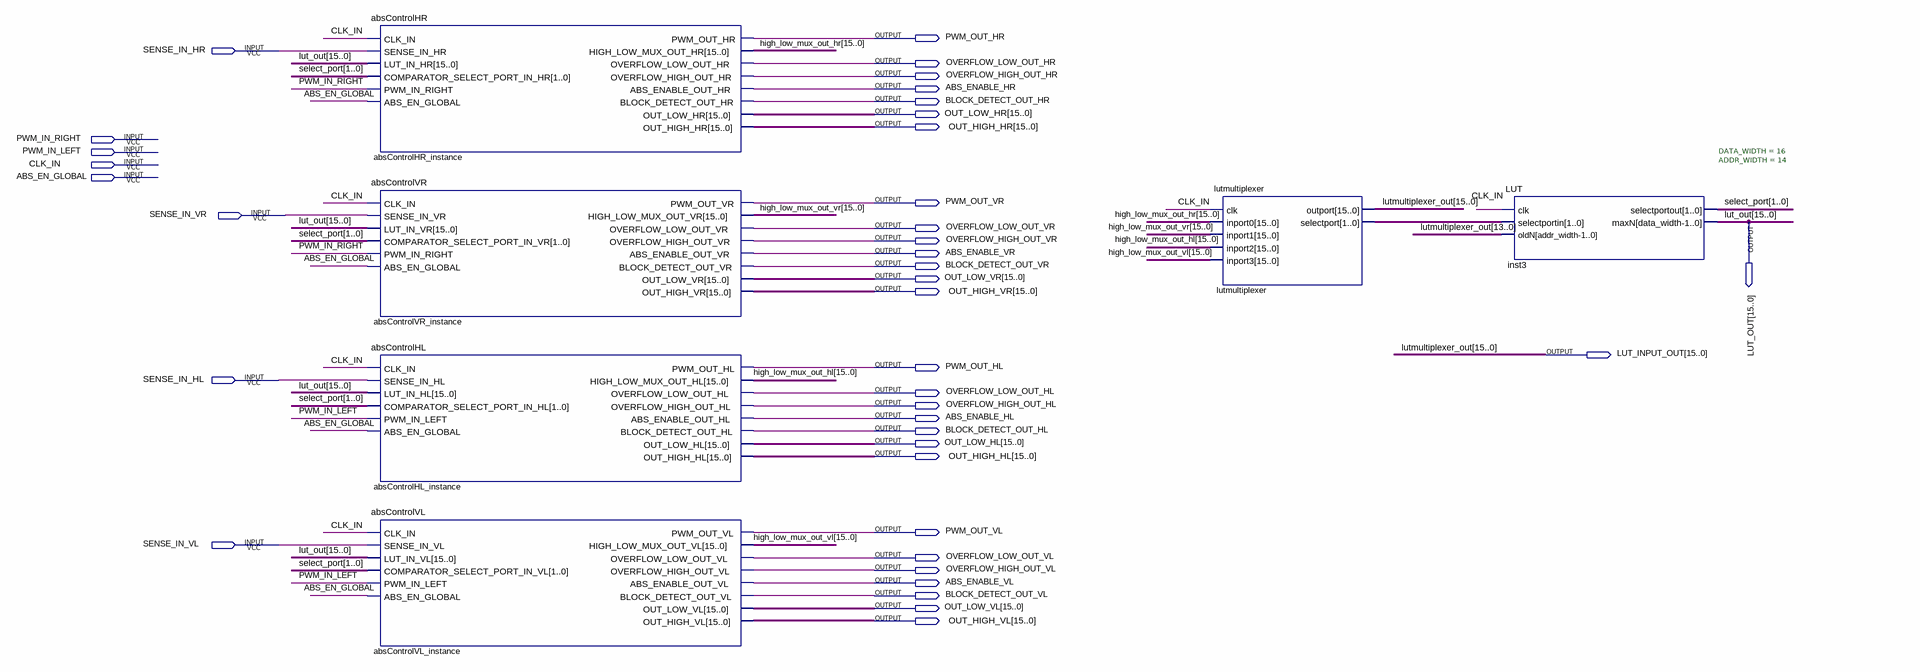
[diagram p0: schematic sheet]
// Quartus schematic controlBlock.bdf as structural Verilog: 6 symbols, 38 pins
module controlBlock (
  input  SENSE_IN_HR,
  input  PWM_IN_RIGHT,
  input  PWM_IN_LEFT,
  input  CLK_IN,
  input  ABS_EN_GLOBAL,
  input  SENSE_IN_VR,
  input  SENSE_IN_HL,
  input  SENSE_IN_VL,
  output PWM_OUT_HR,
  output OVERFLOW_LOW_OUT_HR,
  output OVERFLOW_HIGH_OUT_HR,
  output ABS_ENABLE_HR,
  output BLOCK_DETECT_OUT_HR,
  output [15:0] OUT_LOW_HR,
  output [15:0] OUT_HIGH_HR,
  output PWM_OUT_VR,
  output [15:0] LUT_OUT,
  output OVERFLOW_LOW_OUT_VR,
  output OVERFLOW_HIGH_OUT_VR,
  output ABS_ENABLE_VR,
  output BLOCK_DETECT_OUT_VR,
  output [15:0] OUT_LOW_VR,
  output [15:0] OUT_HIGH_VR,
  output [15:0] LUT_INPUT_OUT,
  output PWM_OUT_HL,
  output OVERFLOW_LOW_OUT_HL,
  output OVERFLOW_HIGH_OUT_HL,
  output ABS_ENABLE_HL,
  output BLOCK_DETECT_OUT_HL,
  output [15:0] OUT_LOW_HL,
  output [15:0] OUT_HIGH_HL,
  output PWM_OUT_VL,
  output OVERFLOW_LOW_OUT_VL,
  output OVERFLOW_HIGH_OUT_VL,
  output ABS_ENABLE_VL,
  output BLOCK_DETECT_OUT_VL,
  output [15:0] OUT_LOW_VL,
  output [15:0] OUT_HIGH_VL
);

  wire [1:0] lutmultiplexer_selectport, select_port;
  wire [15:0] high_low_mux_out_hl, high_low_mux_out_hr, high_low_mux_out_vl, high_low_mux_out_vr;

  absControlHR absControlHR_instance (
    .CLK_IN(CLK_IN), .SENSE_IN_HR(SENSE_IN_HR), .LUT_IN_HR(LUT_OUT),
    .COMPARATOR_SELECT_PORT_IN_HR(select_port), .PWM_IN_RIGHT(PWM_IN_RIGHT), .ABS_EN_GLOBAL(ABS_EN_GLOBAL),
    .PWM_OUT_HR(PWM_OUT_HR), .HIGH_LOW_MUX_OUT_HR(high_low_mux_out_hr),
    .OVERFLOW_LOW_OUT_HR(OVERFLOW_LOW_OUT_HR), .OVERFLOW_HIGH_OUT_HR(OVERFLOW_HIGH_OUT_HR),
    .ABS_ENABLE_OUT_HR(ABS_ENABLE_HR), .BLOCK_DETECT_OUT_HR(BLOCK_DETECT_OUT_HR), .OUT_LOW_HR(OUT_LOW_HR),
    .OUT_HIGH_HR(OUT_HIGH_HR));
  absControlVR absControlVR_instance (
    .CLK_IN(CLK_IN), .SENSE_IN_VR(SENSE_IN_VR), .LUT_IN_VR(LUT_OUT),
    .COMPARATOR_SELECT_PORT_IN_VR(select_port), .PWM_IN_RIGHT(PWM_IN_RIGHT), .ABS_EN_GLOBAL(ABS_EN_GLOBAL),
    .PWM_OUT_VR(PWM_OUT_VR), .HIGH_LOW_MUX_OUT_VR(high_low_mux_out_vr),
    .OVERFLOW_LOW_OUT_VR(OVERFLOW_LOW_OUT_VR), .OVERFLOW_HIGH_OUT_VR(OVERFLOW_HIGH_OUT_VR),
    .ABS_ENABLE_OUT_VR(ABS_ENABLE_VR), .BLOCK_DETECT_OUT_VR(BLOCK_DETECT_OUT_VR), .OUT_LOW_VR(OUT_LOW_VR),
    .OUT_HIGH_VR(OUT_HIGH_VR));
  absControlHL absControlHL_instance (
    .CLK_IN(CLK_IN), .SENSE_IN_HL(SENSE_IN_HL), .LUT_IN_HL(LUT_OUT),
    .COMPARATOR_SELECT_PORT_IN_HL(select_port), .PWM_IN_LEFT(PWM_IN_LEFT), .ABS_EN_GLOBAL(ABS_EN_GLOBAL),
    .PWM_OUT_HL(PWM_OUT_HL), .HIGH_LOW_MUX_OUT_HL(high_low_mux_out_hl),
    .OVERFLOW_LOW_OUT_HL(OVERFLOW_LOW_OUT_HL), .OVERFLOW_HIGH_OUT_HL(OVERFLOW_HIGH_OUT_HL),
    .ABS_ENABLE_OUT_HL(ABS_ENABLE_HL), .BLOCK_DETECT_OUT_HL(BLOCK_DETECT_OUT_HL), .OUT_LOW_HL(OUT_LOW_HL),
    .OUT_HIGH_HL(OUT_HIGH_HL));
  absControlVL absControlVL_instance (
    .CLK_IN(CLK_IN), .SENSE_IN_VL(SENSE_IN_VL), .LUT_IN_VL(LUT_OUT),
    .COMPARATOR_SELECT_PORT_IN_VL(select_port), .PWM_IN_LEFT(PWM_IN_LEFT), .ABS_EN_GLOBAL(ABS_EN_GLOBAL),
    .PWM_OUT_VL(PWM_OUT_VL), .HIGH_LOW_MUX_OUT_VL(high_low_mux_out_vl),
    .OVERFLOW_LOW_OUT_VL(OVERFLOW_LOW_OUT_VL), .OVERFLOW_HIGH_OUT_VL(OVERFLOW_HIGH_OUT_VL),
    .ABS_ENABLE_OUT_VL(ABS_ENABLE_VL), .BLOCK_DETECT_OUT_VL(BLOCK_DETECT_OUT_VL), .OUT_LOW_VL(OUT_LOW_VL),
    .OUT_HIGH_VL(OUT_HIGH_VL));
  lutmultiplexer lutmultiplexer (
    .clk(CLK_IN), .inport0(high_low_mux_out_hr), .inport1(high_low_mux_out_vr),
    .inport2(high_low_mux_out_hl), .inport3(high_low_mux_out_vl), .outport(LUT_INPUT_OUT),
    .selectport(lutmultiplexer_selectport));
  LUT #(.DATA_WIDTH(16), .ADDR_WIDTH(14)) inst3 (
    .clk(CLK_IN), .selectportin(lutmultiplexer_selectport), .oldN(LUT_INPUT_OUT[13:0]),
    .selectportout(select_port), .maxN(LUT_OUT));

  // Other names for the same wires on the sheet: lutmultiplexer_out[15:0] = LUT_INPUT_OUT
endmodule
